# EAGLE design lp_lcd (EAGLE 6.5.0)
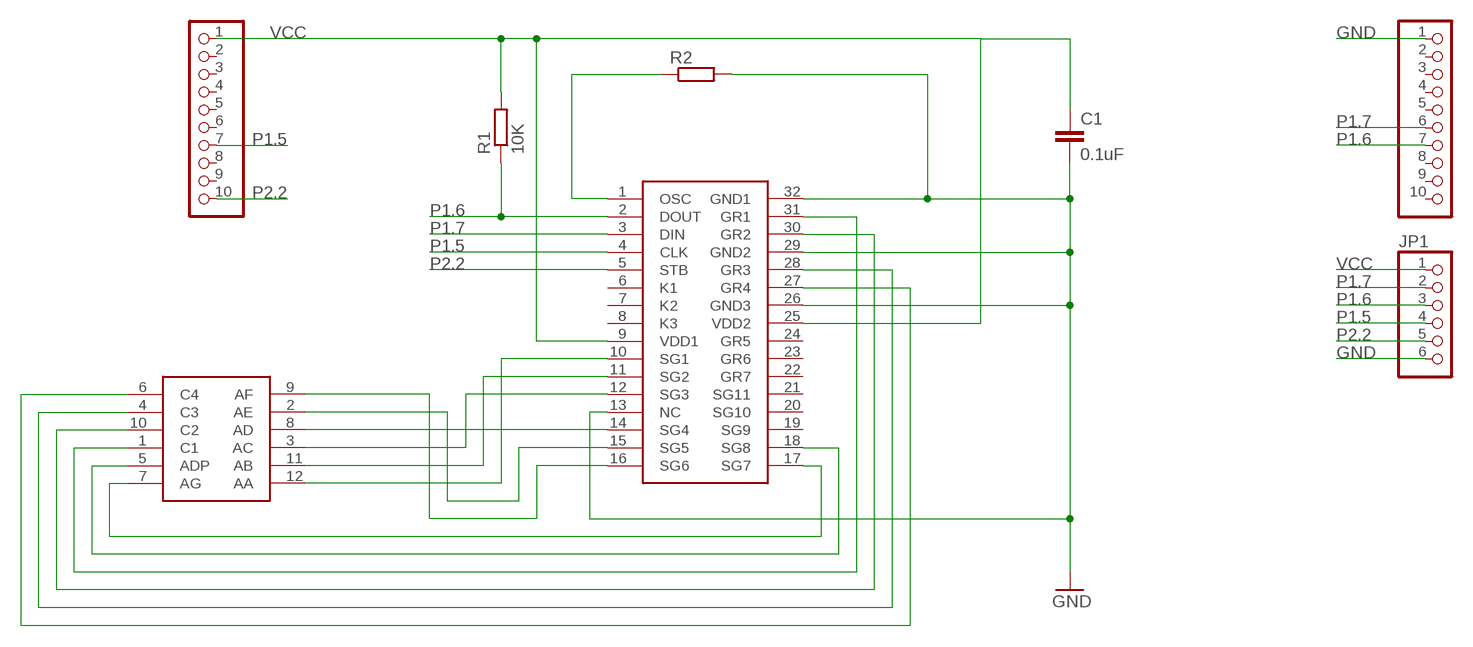
[diagram p0: schematic, sheet 1]

## Parts
C1  0.1uF  C-EUC0805  [C0805]
J1  J1  PINHD-1X10  [1X10]
J2  J2  PINHD-1X10  [1X10]
JP1  PINHD-1X6  [1X06]
R1  10K  R-EU_R0805  [R0805]
R2  R-EU_R0805  [R0805]
U$1  PT6961  [PT6961]
U$2  HP5082-7414  [HP5082-7414]

## Nets
GND [GND]: C1.2 J2.1 JP1.6 R2.2 U$1.13(NC) U$1.26(GND3) U$1.29(GND2) U$1.32(GND1)
N$1: U$1.10(SG1) U$2.12(AA)
N$2: R2.1 U$1.1(OSC)
N$4: U$1.11(SG2) U$2.11(AB)
N$5: U$1.12(SG3) U$2.3(AC)
N$6: U$1.14(SG4) U$2.8(AD)
N$7: U$1.15(SG5) U$2.2(AE)
N$8: U$1.16(SG6) U$2.9(AF)
N$9: U$1.17(SG7) U$2.7(AG)
N$10: U$1.18(SG8) U$2.5(ADP)
N$11: U$1.31(GR1) U$2.1(C1)
N$12: U$1.30(GR2) U$2.10(C2)
N$13: U$1.28(GR3) U$2.4(C3)
N$14: U$1.27(GR4) U$2.6(C4)
P1.5: J1.7 JP1.4 U$1.4(CLK)
P1.6: J2.7 JP1.3 R1.1 U$1.2(DOUT)
P1.7: J2.6 JP1.2 U$1.3(DIN)
P2.2: J1.10 JP1.5 U$1.5(STB)
VCC [VCC]: C1.1 J1.1 JP1.1 R1.2 U$1.9(VDD1) U$1.25(VDD2)
Unconnected: J1.2 J1.3 J1.4 J1.5 J1.6 J1.8 J1.9 J2.2 J2.3 J2.4 J2.5 J2.8 J2.9 J2.10 U$1.6(K1) U$1.7(K2) U$1.8(K3) U$1.19(SG9) U$1.20(SG10) U$1.21(SG11) U$1.22(GR7) U$1.23(GR6) U$1.24(GR5)

## Library data of the parts
C1 = rcl:C-EU: CAPACITOR, European symbol
J1 J2 = pinhead:PINHD-1X10: PIN HEADER
JP1 = pinhead:PINHD-1X6: PIN HEADER
R1 R2 = rcl:R-EU_: RESISTOR, European symbol
U$1 = thierry_eagle:PT6961
U$2 = thierry_eagle:HP5082-7414

## Net classes
0 default: width 0.406 mm, drill 0.508 mm
1 GND: width 0.813 mm, drill 0.508 mm
2 VCC: width 0.813 mm, drill 0.508 mm

## Board
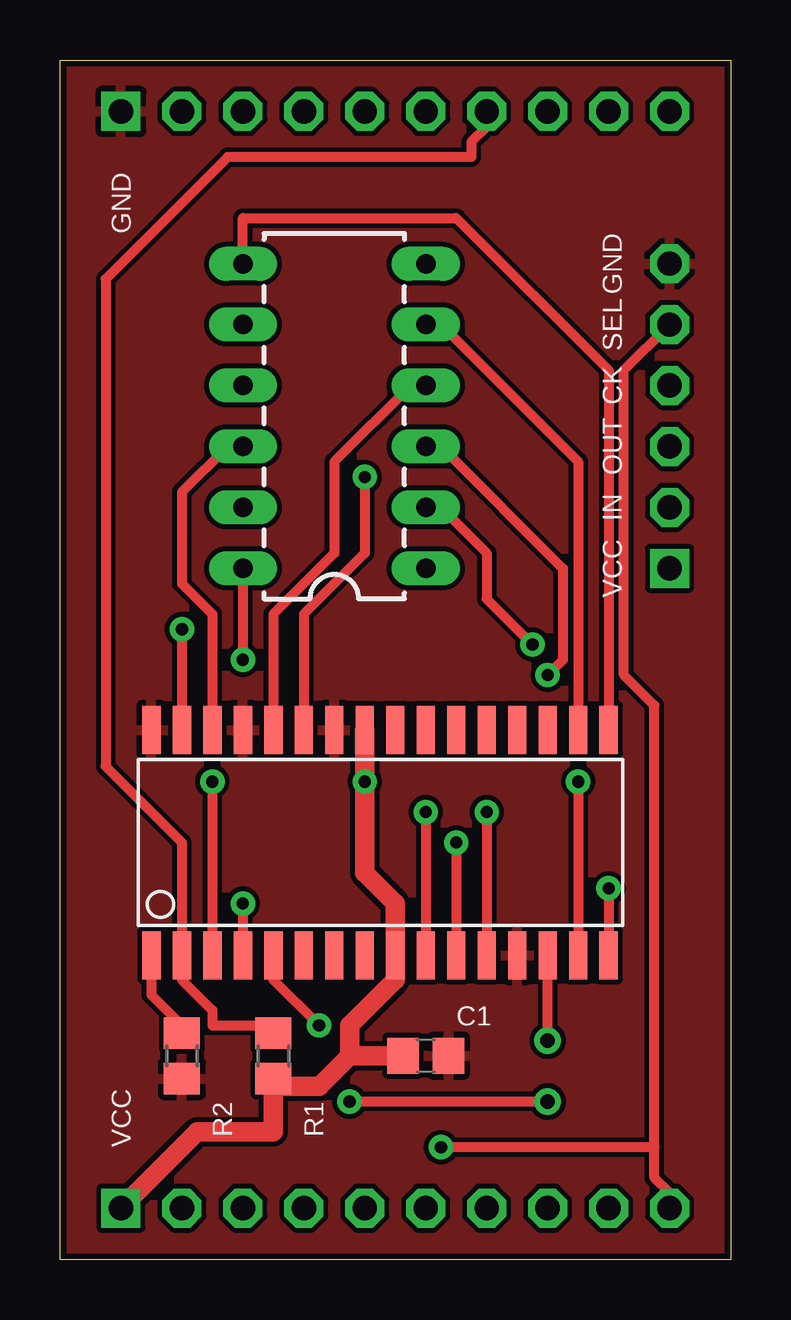
[diagram p1: board, top side]
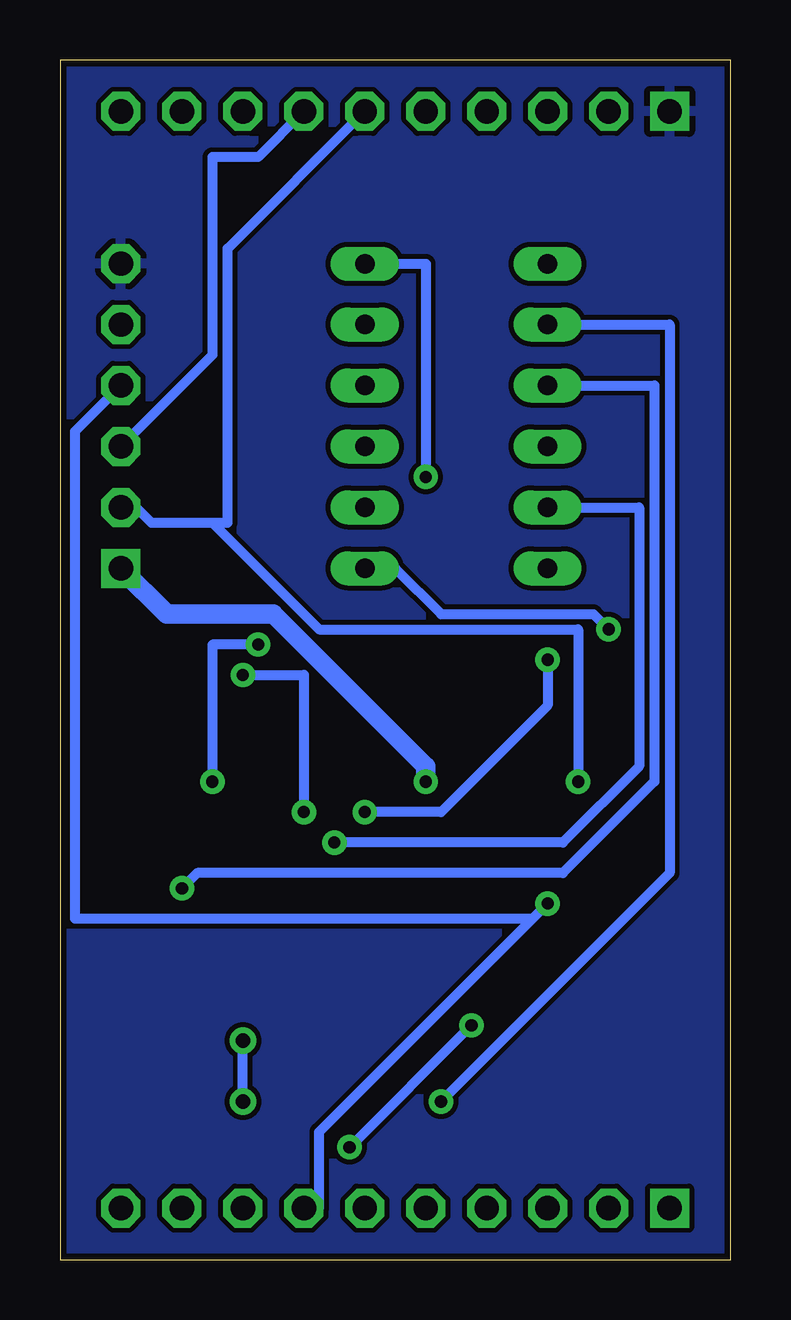
[diagram p2: board, bottom side, seen from below]

Size 27.94 x 50 mm. Coordinates in mm from the lower left corner, seen from the top.
Outline: 0,50 27.94,50 27.94,0 0,0 0,50
Copper layers (1*16): Top 0.035mm / dielectric 1.5mm / Bottom 0.035mm
Design rules "SparkFun *": minimum track width 10mil, minimum drill 20mil, track to track 8mil, track to pad 8mil, pad to pad 8mil, via to via 8mil, smd to smd 8mil, copper to edge 10mil, drill to drill 8mil, minimum pad ring 12mil, minimum via ring 10mil, stop-mask expansion 4mil, vias tented up to drill 25mil, thermal gap 10mil

### Footprints (pad centres in the part's own frame; a part is rotated, then mirrored left to right if it is on the bottom)
C0805 = smd 1.3 x 1.5: 1 -0.95,0; 2 0.95,0
1X10 = drill 1.016 square: 1 -11.43,0 | drill 1.016 octagon: 2 -8.89,0; 3 -6.35,0; 4 -3.81,0; 5 -1.27,0; 6 1.27,0; 7 3.81,0; 8 6.35,0; 9 8.89,0; 10 11.43,0
1X06 = drill 1.016 square: 1 -6.35,0 | drill 1.016 octagon: 2 -3.81,0; 3 -1.27,0; 4 1.27,0; 5 3.81,0; 6 6.35,0
R0805 = smd 1.3 x 1.5: 1 -0.95,0; 2 0.95,0
PT6961 = smd 0.762 x 2: 1 -8.89,-4.7; 2 -7.62,-4.7; 3 -6.35,-4.7; 4 -5.08,-4.7; 5 -3.81,-4.7; 6 -2.54,-4.7; 7 -1.27,-4.7; 8 0,-4.7; 9 1.27,-4.7; 10 2.54,-4.7; 11 3.81,-4.7; 12 5.08,-4.7; 13 6.35,-4.7; 14 7.62,-4.7; 15 8.89,-4.7; 16 10.16,-4.7; 17 10.16,4.7; 18 8.89,4.7; 19 7.62,4.7; 20 6.35,4.7; 21 5.08,4.7; 22 3.81,4.7; 23 2.54,4.7; 24 1.27,4.7; 25 0,4.7; 26 -1.27,4.7; 27 -2.54,4.7; 28 -3.81,4.7; 29 -5.08,4.7; 30 -6.35,4.7; 31 -7.62,4.7; 32 -8.89,4.7
HP5082-7414 = drill 0.813 long: 1 -7.62,-3.81; 2 -5.08,-3.81; 3 -2.54,-3.81; 4 0,-3.81; 5 2.54,-3.81; 6 5.08,-3.81; 7 5.08,3.81; 8 2.54,3.81; 9 0,3.81; 10 -2.54,3.81; 11 -5.08,3.81; 12 -7.62,3.81

### Placement (x,y rotation side)
C1  15.24,8.49 0 top
J1  13.97,2.14 0 top
J2  13.97,47.86 0 top
JP1  25.4,35.16 90 top
R1  8.89,8.49 270 top
R2  5.08,8.49 270 top
U$1  12.7,17.38 0 top
U$2  11.43,36.43 90 top

### Tracks (layer width: path | path; a pad name or v marks a point on that pad's centre or on a via)
GND
  pour Bottom: -1.37,51.47 29.17,51.47 29.17,-1.67 -1.37,-1.77
  pour Top: -1.37,51.47 29.21,51.47 29.21,-1.67 -1.37,-1.77
N$1  (via drill 0.51)
  Top 0.406: v15.24,18.65 U$1.10 | U$2.12 v7.62,25
  Bottom 0.406: v15.24,18.65 12.06,18.65 7.62,23.1 v7.62,25
N$2
  Top 0.406: U$1.1 3.81,11.03 5.08,9.76 R2.1
N$4  (via drill 0.51)
  Top 0.406: v16.51,17.38 U$1.11
  Bottom 0.406: v16.51,17.38 6.99,17.38 3.81,20.55 3.81,31.35 U$2.11
N$5  (via drill 0.51)
  Top 0.406: v17.78,18.65 U$1.12 | v20.32,24.37 20.95,25 20.95,28.81 15.88,33.89 U$2.3
  Bottom 0.406: v17.78,18.65 17.78,24.37 v20.32,24.37
N$6  (via drill 0.51, 0.6 pad 0.51)
  Top 0.406: v20.32,9.12 U$1.14 | v12.06,6.58 v20.32,6.58
  Bottom 0.406: v20.32,6.58 v20.32,9.12 | v12.06,6.58 2.54,16.11 2.54,38.97 U$2.8
N$7  (via drill 0.51)
  Top 0.406: v21.59,19.92 U$1.15 | v19.68,25.64 17.78,27.54 17.78,29.45 15.88,31.35 U$2.2
  Bottom 0.406: v21.59,19.92 21.59,25.64 v19.68,25.64
N$8  (via drill 0.51)
  Top 0.406: v22.86,15.47 U$1.16
  Bottom 0.406: v22.86,15.47 22.23,16.11 6.99,16.11 3.17,19.92 3.17,36.43 U$2.9
N$9
  Top 0.406: U$1.17 22.86,37.07 16.51,43.41 7.62,43.41 U$2.7
N$10
  Top 0.406: U$1.18 21.59,33.26 15.88,38.97 U$2.5
N$11  (via drill 0.51)
  Top 0.406: v5.08,26.27 U$1.31
  Bottom 0.406: v5.08,26.27 5.71,26.91 12.06,26.91 13.97,28.81 U$2.1
N$12
  Top 0.406: U$1.30 6.35,26.91 5.08,28.18 5.08,31.98 6.99,33.89 U$2.10
N$13
  Top 0.406: U$1.28 8.89,26.91 11.43,29.45 11.43,33.26 14.61,36.43 U$2.4
N$14  (via drill 0.51)
  Top 0.406: U$1.27 10.16,26.91 12.7,29.45 v12.7,32.62
  Bottom 0.406: v12.7,32.62 12.7,41.51 U$2.6
P1.5  (via drill 0.51)
  Top 0.406: v7.62,14.84 U$1.4
  Bottom 0.406: 8.26,14.21 17.14,5.31 17.14,2.14 J1.7 | 8.26,14.21 v7.62,14.84 | JP1.4 27.3,34.52 27.3,14.21 8.26,14.21
P1.6
  Top 0.406: R1.1 8.89,9.76 6.35,9.76 6.35,10.39 5.08,11.66 U$1.2 5.08,17.38 1.91,20.55 1.91,40.88 6.99,45.95 17.14,45.95 17.14,46.59 17.78,47.23 J2.7
  Bottom 0.406: JP1.3 21.59,37.7 21.59,45.95 19.68,45.95 J2.7
P1.7  (via drill 0.51)
  Top 0.406: v6.35,19.92 U$1.3
  Bottom 0.406: v6.35,19.92 6.35,26.27 17.14,26.27 21.59,30.71 | 21.59,30.71 24.13,30.71 24.77,31.35 JP1.2 | J2.6 20.95,42.15 20.95,30.71 21.59,30.71
P2.2  (via drill 0.51)
  Top 0.406: U$1.5 8.89,11.66 v10.79,9.76 | 24.77,4.68 v15.88,4.68 | 24.77,4.68 24.77,3.41 25.4,2.77 J1.10 | JP1.5 23.5,37.07 23.5,24.37 24.77,23.1 24.77,4.68
  Bottom 0.406: v15.88,4.68 v10.79,9.76
VCC  (via drill 0.51)
  Top 0.813: 8.89,7.22 10.79,7.22 12.06,8.49 | C1.1 12.06,8.49 | 12.06,8.49 12.06,9.76 13.97,11.66 U$1.9 13.97,14.84 12.7,16.11 v12.7,19.92 U$1.25 | J1.1 5.71,5.31 8.89,5.31 8.89,7.22 | 8.89,7.22 R1.2
  Bottom 0.813: JP1.1 23.5,26.91 19.05,26.91 12.7,20.55 v12.7,19.92

### Text on the board
tNames: GND | GND | SEL | CK | OUT | IN | VCC | VCC